# Altium schematic sheet MCU_Core.SchDoc
size A3; SheetNumber: 3; SheetTotal: 5
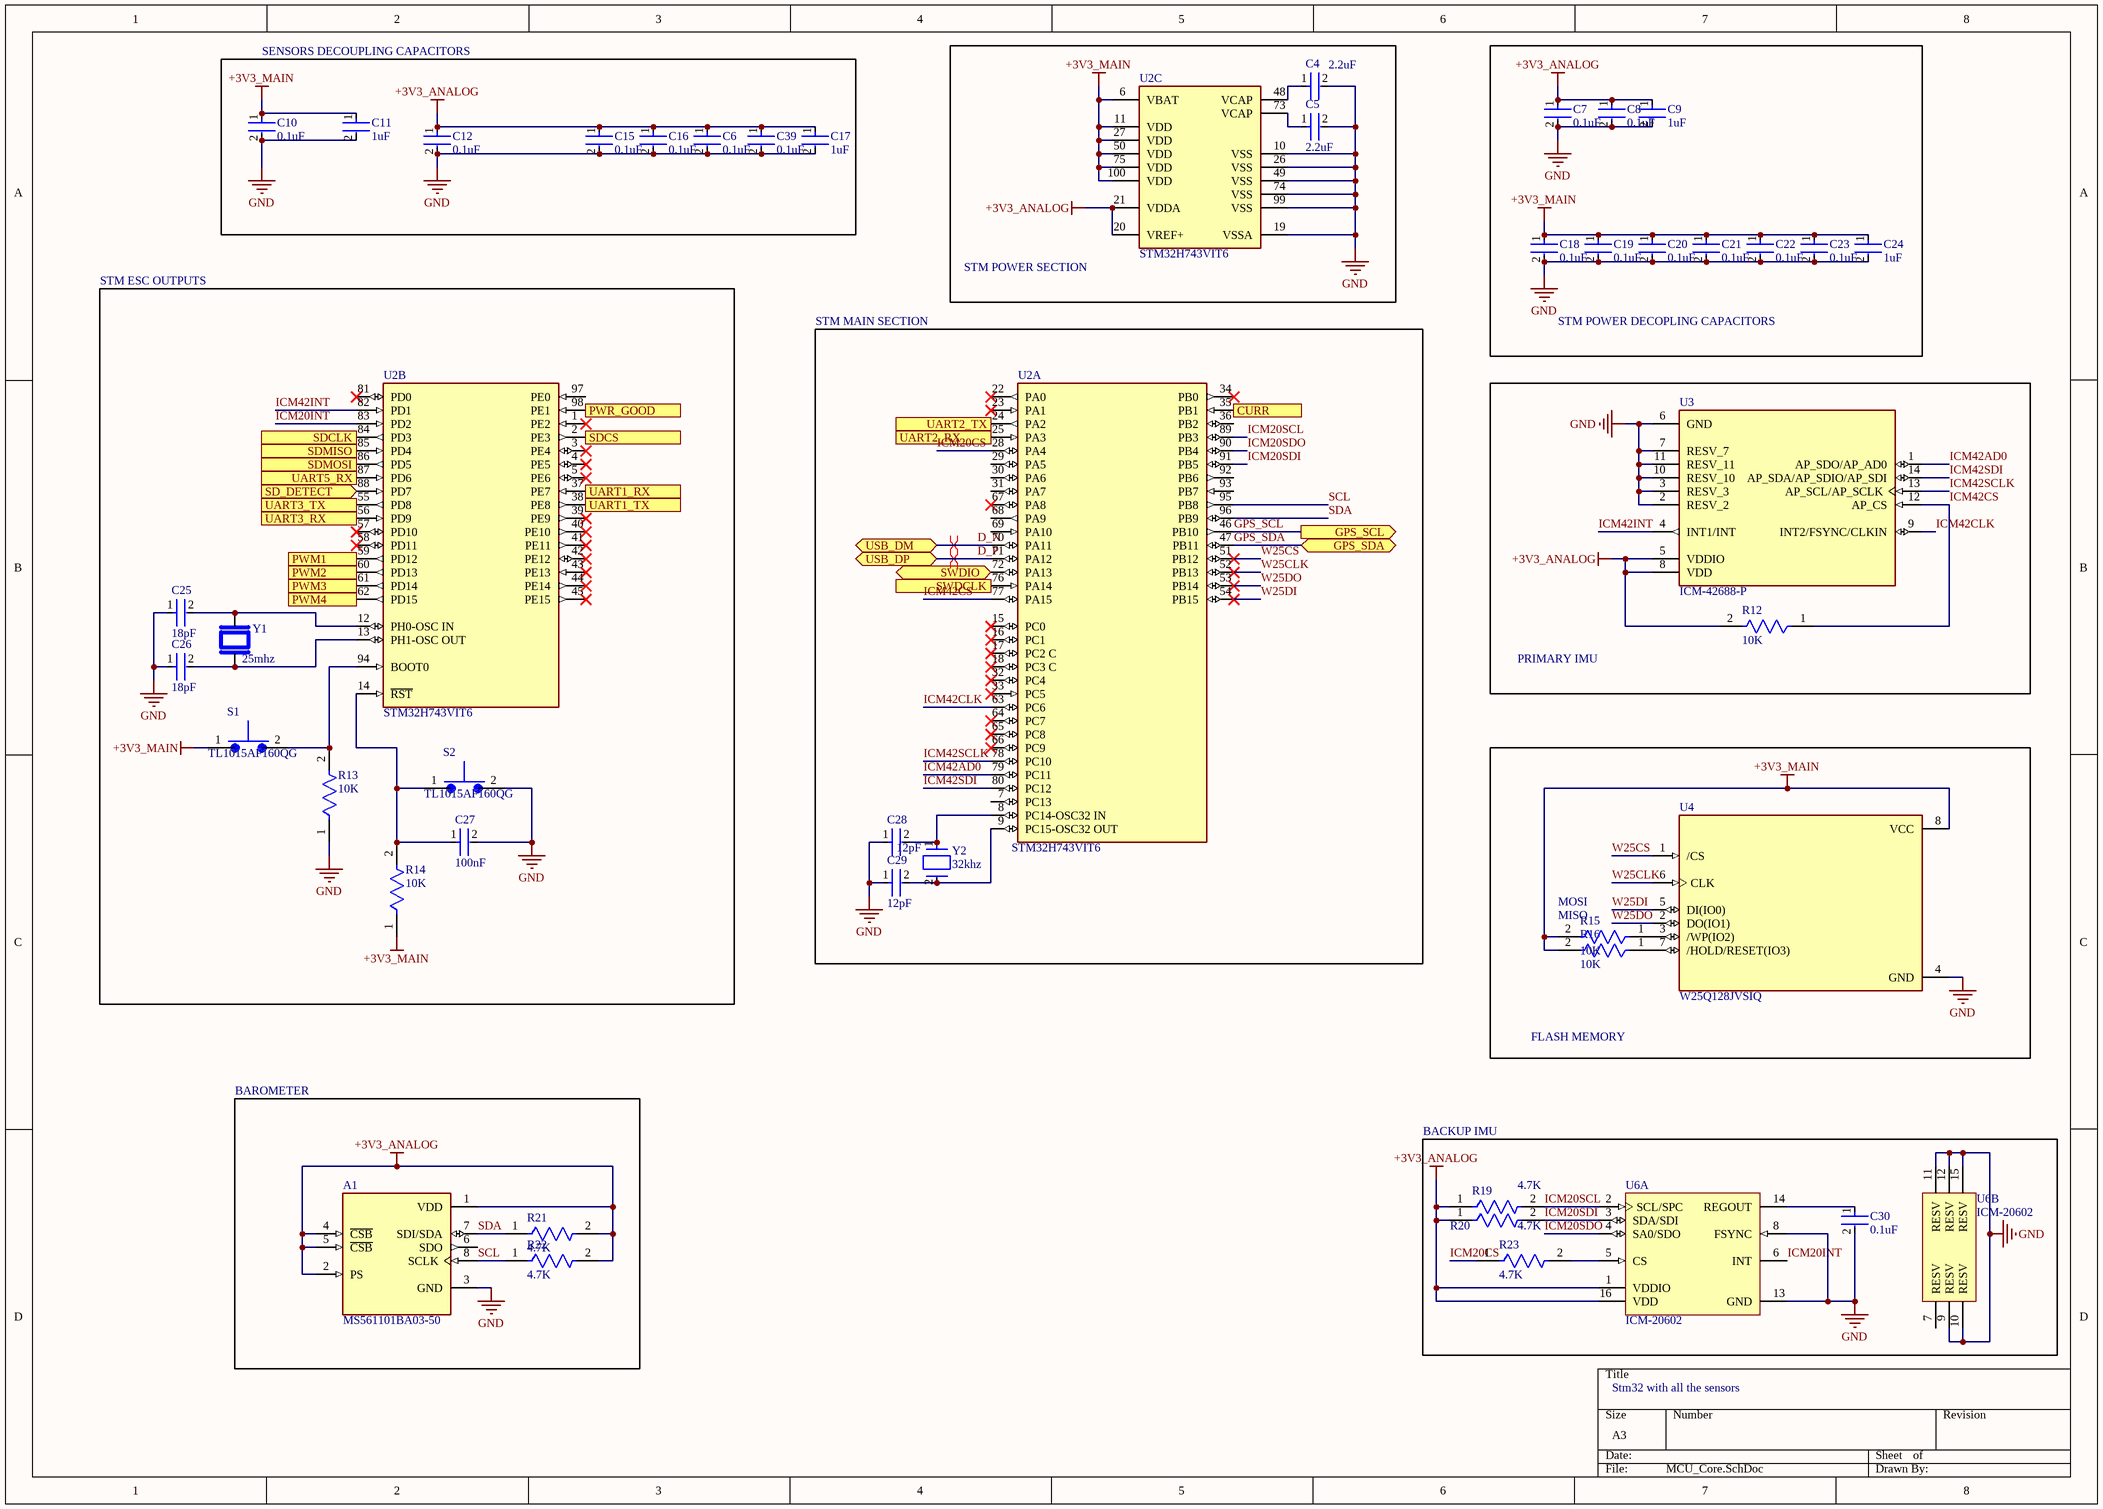
[diagram p0: MCU_Core.SchDoc]

## Parts
A1  MS561101BA03-50  [XDCR_MS561101BA03-50]
C4  2.2uF  [FP-GRM155-0_15-IPC_A]
C5  2.2uF  [FP-GRM155-0_15-IPC_A]
C6  0.1uF  [FP-C0402-BB-MFG]
C7  0.1uF  [FP-C0402-BB-MFG]
C8  0.1uF  [FP-C0402-BB-MFG]
C9  1uF  [FP-GRM152-0_05-MFG]
C10  0.1uF  [FP-C0402-BB-MFG]
C11  1uF  [FP-GRM152-0_05-MFG]
C12  0.1uF  [FP-C0402-BB-MFG]
C15  0.1uF  [FP-C0402-BB-MFG]
C16  0.1uF  [FP-C0402-BB-MFG]
C17  1uF  [FP-GRM152-0_05-MFG]
C18  0.1uF  [FP-C0402-BB-MFG]
C19  0.1uF  [FP-C0402-BB-MFG]
C20  0.1uF  [FP-C0402-BB-MFG]
C21  0.1uF  [FP-C0402-BB-MFG]
C22  0.1uF  [FP-C0402-BB-MFG]
C23  0.1uF  [FP-C0402-BB-MFG]
C24  1uF  [FP-GRM152-0_05-MFG]
C25  18pF  [FP-C0402-BB-MFG]
C26  18pF  [FP-C0402-BB-MFG]
C27  100nF  [FP-C0402-BB-MFG]
C28  12pF  [FP-C0402-BB-MFG]
C29  12pF  [FP-C0402-BB-MFG]
C30  0.1uF  [FP-C0402-BB-MFG]
C39  0.1uF  [FP-C0402-BB-MFG]
R12  10K  [FP-MCS0402-MFG]
R13  10K  [FP-MCS0402-MFG]
R14  10K  [FP-MCS0402-MFG]
R15  10K  [FP-MCS0402-MFG]
R16  10K  [FP-MCS0402-MFG]
R19  4.7K  [FP-CRCW0402-Pe3-IPC_C]
R20  4.7K  [FP-CRCW0402-Pe3-IPC_C]
R21  4.7K  [FP-CRCW0402-Pe3-IPC_C]
R22  4.7K  [FP-CRCW0402-Pe3-IPC_C]
R23  4.7K  [FP-CRCW0402-Pe3-IPC_C]
S1  TL1015AF160QG  [SW_TL1015AF160QG]
S2  TL1015AF160QG  [SW_TL1015AF160QG]
U2  STM32H743VIT6  [FP-LQFP100-1L-MFG]  (parts A,B,C of 3)
U3  ICM-42688-P  [PQFN50P300X250X97-14N]
U4  W25Q128JVSIQ  [SOIC127P790X216-8N]
U6  ICM-20602  [INSE-I62-16]  (parts A,B of 2)
Y1  25mhz  [XTAL_SXT32412BB07-25.000MT]
Y2  32khz  [FP-ABS07-MFG]

## Blocks framed on the sheet
SENSORS DECOUPLING CAPACITORS: C6 C10-C12 C15-C17 C39
STM POWER SECTION: C4 C5 U2
STM POWER DECOPLING CAPACITORS: C7-C9 C18-C24
STM ESC OUTPUTS: C25-C27 R13 R14 S1 S2 U2 Y1
STM MAIN SECTION: C28 C29 U2 Y2
PRIMARY IMU: R12 U3
BAROMETER: A1 R21 R22
BACKUP IMU: C30 R19 R20 R23 U6

## Ports
CURR (in, see EMP_FC_Main[2C], Motor_Outputs[3B]), GPS_SCL (out, see EMP_FC_Main[2C], Communication[6A]), GPS_SDA (bidir, see EMP_FC_Main[2C], Communication[6A]), PWM1 (out, see EMP_FC_Main[2C], Motor_Outputs[1B]), PWM2 (out, see EMP_FC_Main[2C], Motor_Outputs[1C]), PWM3 (out, see EMP_FC_Main[2C], Motor_Outputs[1C]), PWM4 (out, see EMP_FC_Main[2C], Motor_Outputs[1C]), PWR_GOOD (in, see EMP_FC_Main[2C], Power_Management[7A]), SD_DETECT (in, see EMP_FC_Main[2B], Communication[2C]), SDCLK (out, see EMP_FC_Main[3C], Communication[2C]), SDCS (out, see EMP_FC_Main[3C], Communication[2C]), SDMISO (in, see EMP_FC_Main[3C], Communication[2C]), SDMOSI (out, see EMP_FC_Main[2C], Communication[2C]), SWDCLK (in, see EMP_FC_Main[3C], Communication[4C]), SWDIO (bidir, see EMP_FC_Main[3C], Communication[4C]), UART1_RX (in, see EMP_FC_Main[2B], Communication[4A]), UART1_TX (out, see EMP_FC_Main[2B], Communication[4A]), UART2_RX (in, see EMP_FC_Main[3B], Communication[5C]), UART2_TX (out, see EMP_FC_Main[3B], Communication[5C]), UART3_RX (in, see EMP_FC_Main[3C], Communication[6A]), UART3_TX (out, see EMP_FC_Main[3B], Communication[6A]), UART5_RX (in, see EMP_FC_Main[2C], Motor_Outputs[4B]), USB_DM (bidir, see EMP_FC_Main[2B], Communication[2A]), USB_DP (bidir, see EMP_FC_Main[2B], Communication[2A])

## Nets
+3V3_ANALOG: A1.1(VDD) A1.2(PS) A1.4(~{CSB}) A1.5(~{CSB}) C6.1 C7.1 C8.1 C9.1 C12.1 C15.1 C16.1 C17.1 C39.1 R12.2 R19.1 R20.1 R21.2 R22.2 U2.20(VREF+) U2.21(VDDA) U3.5(VDDIO) U3.8(VDD) U6.1(VDDIO) U6.16(VDD)
+3V3_MAIN: C10.1 C11.1 C18.1 C19.1 C20.1 C21.1 C22.1 C23.1 C24.1 R14.1 R15.2 R16.2 S1.1 U2.6(VBAT) U2.11(VDD) U2.27(VDD) U2.50(VDD) U2.75(VDD) U2.100(VDD) U4.8(VCC)
GND: A1.3(GND) C4.2 C5.2 C6.2 C7.2 C8.2 C9.2 C10.2 C11.2 C12.2 C15.2 C16.2 C17.2 C18.2 C19.2 C20.2 C21.2 C22.2 C23.2 C24.2 C25.1 C26.1 C27.2 C28.1 C29.1 C30.2 C39.2 R13.1 S2.2 U2.10(VSS) U2.19(VSSA) U2.26(VSS) U2.49(VSS) U2.74(VSS) U2.99(VSS) U3.2(RESV_2) U3.3(RESV_3) U3.6(GND) U3.7(RESV_7) U3.10(RESV_10) U3.11(RESV_11) U4.4(GND) U6.8(FSYNC) U6.9(RESV) U6.10(RESV) U6.11(RESV) U6.12(RESV) U6.13(GND) U6.15(RESV)
CURR: U2.35(PB1) ; port CURR
D_N: U2.70(PA11) ; port USB_DM
D_P: U2.71(PA12) ; port USB_DP
GPS_SCL: U2.46(PB10) ; port GPS_SCL
GPS_SDA: U2.47(PB11) ; port GPS_SDA
ICM20CS: R23.1 U2.28(PA4)
ICM20INT: U2.83(PD2) U6.6(INT)
ICM20SCL: R19.2 U2.89(PB3) U6.2(SCL/SPC)
ICM20SDI: R20.2 U2.91(PB5) U6.3(SDA/SDI)
ICM20SDO: U2.90(PB4) U6.4(SA0/SDO)
ICM42AD0: U2.79(PC11) U3.1(AP_SDO/AP_AD0)
ICM42CLK: U2.63(PC6) U3.9(INT2/FSYNC/CLKIN)
ICM42CS: R12.1 U2.77(PA15) U3.12(AP_CS)
ICM42INT: U2.82(PD1) U3.4(INT1/INT)
ICM42SCLK: U2.78(PC10) U3.13(AP_SCL/AP_SCLK)
ICM42SDI: U2.80(PC12) U3.14(AP_SDA/AP_SDIO/AP_SDI)
PWM1: U2.59(PD12) ; port PWM1
PWM2: U2.60(PD13) ; port PWM2
PWM3: U2.61(PD14) ; port PWM3
PWM4: U2.62(PD15) ; port PWM4
PWR_GOOD: U2.98(PE1) ; port PWR_GOOD
SCL: A1.8(SCLK) R22.1 U2.95(PB8)
SD_DETECT: U2.88(PD7) ; port SD_DETECT
SDA: A1.7(SDI/SDA) R21.1 U2.96(PB9)
SDCLK: U2.84(PD3) ; port SDCLK
SDCS: U2.2(PE3) ; port SDCS
SDMISO: U2.85(PD4) ; port SDMISO
SDMOSI: U2.86(PD5) ; port SDMOSI
SWDCLK: U2.76(PA14) ; port SWDCLK
SWDIO: U2.72(PA13) ; port SWDIO
UART1_RX: U2.37(PE7) ; port UART1_RX
UART1_TX: U2.38(PE8) ; port UART1_TX
UART2_RX: U2.25(PA3) ; port UART2_RX
UART2_TX: U2.24(PA2) ; port UART2_TX
UART3_RX: U2.56(PD9) ; port UART3_RX
UART3_TX: U2.55(PD8) ; port UART3_TX
UART5_RX: U2.87(PD6) ; port UART5_RX
W25CLK: U2.52(PB13) U4.6(CLK)
W25CS: U2.51(PB12) U4.1(/CS)
W25DI: U2.54(PB15) U4.5(DI(IO0))
W25DO: U2.53(PB14) U4.2(DO(IO1))
NetC4_1: C4.1 U2.48(VCAP)
NetC5_1: C5.1 U2.73(VCAP)
NetC25_2: C25.2 U2.12(PH0-OSC_IN) Y1.3
NetC26_2: C26.2 U2.13(PH1-OSC_OUT) Y1.1
NetC27_1: C27.1 R14.2 S2.1 U2.14(~{RST})
NetC28_2: C28.2 U2.8(PC14-OSC32_IN) Y2.1
NetC29_2: C29.2 U2.9(PC15-OSC32_OUT) Y2.2
NetC30_1: C30.1 U6.14(REGOUT)
NetR13_2: R13.2 S1.2 U2.94(BOOT0)
NetR15_1: R15.1 U4.3(/WP(IO2))
NetR16_1: R16.1 U4.7(/HOLD/RESET(IO3))
NetR23_2: R23.2 U6.5(CS)

Not connected (* = marked no-connect by the designer): A1 6(SDO); U2 1(PE2)* 3(PE4)* 4(PE5)* 5(PE6)* 7(PC13) 15(PC0)* 16(PC1)* 17(PC2_C)* 18(PC3_C)* 22(PA0)* 23(PA1)* 29(PA5) 30(PA6) 31(PA7) 32(PC4)* 33(PC5)* 34(PB0)* 36(PB2) 39(PE9)* 40(PE10)* 41(PE11)* 42(PE12)* 43(PE13)* 44(PE14)* 45(PE15)* 57(PD10)* 58(PD11)* 64(PC7)* 65(PC8)* 66(PC9)* 67(PA8)* 68(PA9) 69(PA10) 81(PD0)* 92(PB6) 93(PB7) 97(PE0); U6 7(RESV)

## Layout directives
differential pair: D_N, D_P

## Notes on the sheet
- MOSI
- (near R15) MISO
- FLASH MEMORY
- Stm32 with all the sensors

## Library data of the parts
A1 = MS561101BA03-50: Sensor;MS5611-BT M-CAPS 3X5X1MM T&R;Pressure;MS561101BA03-50 | TE Connectivity MS561101BA03-50; SnapEDA_Link: https://www.snapeda.com/parts/MS561101BA03-50/TE+Connectivity+ALCOSWITCH+Switches/view-part/?ref=snap; Package: SMD-8 Measurement Specialties; Value: *; MF: TE Connectivity; MP: MS561101BA03-50; Check_prices: https://www.snapeda.com/parts/MS561101BA03-50/TE+Connectivity+ALCOSWITCH+Switches/view-part/?ref=eda
C4 C5 = CMP-06035-048202-1: Chip Multilayer Ceramic Capacitors for General Purpose, 0402, 2.2uF, X7R, 15%, 10%, 10V
C6-C8 C10 C12 C15 C16 C18-C23 C27 C30 C39 = CMP-03020-002733-1: CAP CER 0.1UF 10V X7R 0402; Manufacturer: Kemet; Manufacturer Part Number: C0402C104K8RACAUTO; Material: Ceramic; Value: 0.10 μF; Tolerance: 0.1; Temperature Coefficient: 15%; ComponentLink2Description: Datasheet; Automotive: No; Digikey Description: CAP CER 0.1UF 10V X7R 0402; Temperature Range Low: -55°C; Ipc Land Pattern Name: CAPC10050X50; Lead Free: Yes; Category: Cap; Package: C0402-BB; Octopart: https://octopart.com/c0402c104k8racauto-kemet-9145167; Voltage Rating: 10 V; Device Class L2: Capacitors; Capacitance: 0.10 μF; Temperature Range High: +125°C; Height: 0.55mm; ComponentLink2URL: https://content.kemet.com/datasheets/KEM_C1002_X7R_SMD.pdf; Temperature: -55°C to +125°C; Device Class L1: Passive Components; Temperature Characteristic: X7R; RoHS: TRUE; Device Class L3: Ceramic Capacitors
C9 C11 C17 C24 = CMP-06035-048608-1: Chip Multilayer Ceramic Capacitors for General Purpose, 0402, 1.0uF, X5R, 15%, 20%, 6.3V; Case Code (Metric): 1005; Length: 0.039inch; Mount: Surface Mount; Width: 0.02inch; Voltage Rating (DC): 6.3V; Tolerance: 20%; Thickness: 0.009inch; Dielectric: X5R; Min Operating Temperature: -55°C; Max Operating Temperature: 85°C; Case/Package: 0402; Packaging: Tape and Reel; Case Code (Imperial): 0402; Voltage Rating: 6.3V; Capacitance: 1uF
C25 C26 = CMP-03020-024161-1: C0402 18 pF X8R 5.00% 50 V; Manufacturer: Kemet; Manufacturer Part Number: C0402C180J5HACAUTO; Material: Ceramic; Temperature Coefficient: 15%; Tolerance: 0.05; Voltage Rating: 50 V; Temperature Range Low: -55°C; Octopart: https://octopart.com/c0402c180j5hacauto-kemet-88080534; Device Class L1: Passive Components; Automotive: No; ComponentLink2Description: Datasheet; RoHS: TRUE; Category: Cap; Package: C0402-BB; Temperature Characteristic: X8R; Ipc Land Pattern Name: CAPC10050X50; Temperature Range High: +125°C; Value: 18 pF; Capacitance: 18 pF; Device Class L3: Ceramic Capacitors; ComponentLink2URL: https://content.kemet.com/datasheets/KEM_C1002_X7R_SMD.pdf; Height: 0.55mm; Device Class L2: Capacitors; Temperature: -55°C to +125°C; Lead Free: Yes
C28 C29 = CMP-03020-024996-1: C0402 12 pF X8R 5.00% 50 V; Manufacturer: Kemet; Manufacturer Part Number: C0402C120J5HACTU; Tolerance: 0.05; Temperature Coefficient: 15%; Voltage Rating: 50 V; Material: Ceramic; Device Class L2: Capacitors; Temperature Range Low: -55°C; Temperature Range High: +125°C; Temperature Characteristic: X8R; Device Class L3: Ceramic Capacitors; ComponentLink2Description: Datasheet; Capacitance: 12 pF; Height: 0.55mm; Category: Cap; Package: C0402-BB; Ipc Land Pattern Name: CAPC10050X50; RoHS: TRUE; Lead Free: Yes; Automotive: No; Octopart: https://octopart.com/c0402c120j5hactu-kemet-88724098; Temperature: -55°C to +125°C; Device Class L1: Passive Components; Value: 12 pF; ComponentLink2URL: https://content.kemet.com/datasheets/KEM_C1002_X7R_SMD.pdf
R12-R16 = CMP-02407-000363-1: RES SMD 1.2K OHM 1% 1/10W 0402; Power Rating: 100mW; Temperature Coefficient: 25ppm/°C; Tolerance: 0.5%; Voltage Rating: 50V; Resistance: 10kR; Package Quantity: 10000; Case Code (Metric): 1005; Height: 0.015inch; Termination: SMD/SMT; Features: Automotive AEC-Q200; Packaging: Tape and Reel; Length: 0.039inch; Min Operating Temperature: -55°C; Case/Package: 0402; Max Power Dissipation: 100mW; Case Code (Imperial): 0402; Width: 0.5mm; Contact Plating: Tin; Weight: 2.1E-05oz; Max Operating Temperature: 175°C; Composition: Thin Film; Number of Terminations: 2; Radiation Hardening: No
R19-R23 = CMP-03613-000096-1: RES Thick Film, 4.7kΩ, 1%, 0.063W, 50ppm/°C, 0402; Resistance: 4.7kR; Max Power Dissipation: 63mW; Tolerance: 1%; Package Quantity: 10000; Case/Package: 0402; Max Operating Temperature: 155°C; RoHS Compliant: Yes; Series: CRCW-P; Resistor Type: Thick Film; Number of Terminations: 2; Min Operating Temperature: -55°C; Temperature Coefficient: 50ppm/°C; Features: Automotive AEC-Q200; Length: 0.039inch; Height: 0.016inch; Width: 0.02inch; Packaging: Tape and Reel
S1 S2 = TL1015AF160QG: Tactile Switch SPST-NO Top Actuated Surface Mount; Package: None; Availability: Unavailable; Value: *; MP: TL1015AF160QG; Price: None
U2 = CMP-12105-000050-1: IC MCU 32BIT 2MB FLASH 100LQFP; Manufacturer: STMicroelectronics; Number Of Ethernet Channels: 1; Number Of Usb Channels: 2; Number Of A/D Converters: 3; Min Supply Voltage: 1.71V; Ram Size: 1060KBytes; Number Of I2C Channels: 4; Frequency: 480MHz; Number Of Adc Channels: 36; Number Of I/Os: 82; Max Supply Voltage: 3.6V; Number Of Spi Channels: 6; Memory Size: 2MBytes; Max Junction Temp: +125°C; Core Architecture: Arm Cortex-M7; Interface: I2C,SPI,UART,USART,USB,LIN,IrDA,Ethernet,I2S,Other; Number Of Timers/Counters: 20; Data Bus Width: 32bits; Number Of Pwm Channels: 42; Number Of Uart Channels: 9; Standoff Height: 0.05mm; Device Class L1: Integrated Circuits (ICs); ComponentLink2URL: https://www.st.com/resource/en/datasheet/stm32h743vi.pdf; Automotive: No; Memory Type: FLASH; Number Of Cores: 1; Temperature Range Low: -40°C; RoHS: TRUE; Ambient Temperature Range Low: -40°C; ComponentLink2Description: Datasheet; Device Class L2: Embedded Processors and Controllers; Device Class L3: Microcontrollers; Digikey Description: IC MCU 32BIT 2MB FLASH 100LQFP; Temperature Range High: +125°C; Ambient Temperature Range High: +85°C; Package: LQFP100-1L; Temperature: -40°C to +125°C; Category: IC; Ipc Land Pattern Name: QFP50P1600X1600X160-100; Height: 1.6mm; Manufacturer Part Number: STM32H743VIT6; Octopart: https://octopart.com/stm32h743vit6-stmicroelectronics-76372527; Lead Free: Yes
U3 = ICM-42688-P: Accelerometer, Gyroscope, 6 Axis Sensor Output; Package: None; MP: ICM-42688-P; Value: *; Availability: Unavailable; Price: None
U4 = W25Q128JVSIQ: FLASH - NOR Memory IC 128Mb (16M x 8) SPI - Quad I/O, QPI, DTR 133 MHz 8-SOIC; MF: Winbond Electronics; SnapEDA_Link: https://www.snapeda.com/parts/W25Q128JVSIQ/Winbond/view-part/?ref=snap; Package: SOIC-8 Winbond Electronics; Value: *; MP: W25Q128JVSIQ; Check_prices: https://www.snapeda.com/parts/W25Q128JVSIQ/Winbond/view-part/?ref=eda
U6 = CMP-2000-07589-1: High Performance 6-Axis MEMS MotionTracking(TM) Device, 1.71 to 3.45 V, -40 to 85 degC, 16-Pin LGA, RoHS; Manufacturer: InvenSense; Sensor Type: Temperature; Output Type: I2C; RoHSCompliant: True; Datasheet Version: Rev. 1.0, 10/2016; Datasheet URL: http://www.invensense.com/wp-content/uploads/2016/10/DS-000176-ICM-20602-v1.0.pdf; Min Operating Temperature: -40degC; Mounting Technology: SurfaceMount; Max Operating Temperature: 85degC; Manufacturer URL: http://www.invensense.com/; Package Reference: I62-16; Package Description: 16-Pin Land Grid Array, Body 3 x 3 mm, Pitch 0.5 mm
Y1 = SXT32412BB07-25.000MT: 25 MHz Â±30ppm Crystal 12pF 50 Ohms 4-SMD, No Lead; MF: Suntsu; SnapEDA_Link: https://www.snapeda.com/parts/SXT32412BB07-25.000M/Suntsu/view-part/?ref=snap; Package: NON STANDARD-4 Suntsu; Value: *; MP: SXT32412BB07-25.000M; Check_prices: https://www.snapeda.com/parts/SXT32412BB07-25.000M/Suntsu/view-part/?ref=eda; Supplier 1: DigiKey; Supplier Part Number 1: 535-ABM8N-25.0000MHZ-12-B1U-T3CT-ND
Y2 = CMP-0447-00001-4: Crystal 32.768kHz ±20ppm (Tol) 12.5pF FUND 70kΩ 2-Pin CSMD T/R; ESR (Equivalent Series Resistance): 70kR; Radiation Hardening: No; Frequency: 32.768kHz; Length: 3.2mm; Max Operating Temperature: 85°C; Number of Pins: 2; Series: ABS07; Min Operating Temperature: -40°C; Frequency Tolerance: 20ppm; Packaging: Tape and Reel; Height: 0.9mm; Width: 1.5mm; Depth: 1.5mm; Load Capacitance: 12.5pF; RoHS Compliant: Yes; Tolerance: 20ppm; Termination: SMD/SMT; Lead Free: Lead Free; Series Resistance: 70kR; REACH SVHC: No SVHC; Case/Package: CSMD; Operating Frequency: 32.768 kHz; Package Quantity: 3000